# EAGLE design parallelNGtest (EAGLE 9.5.0)
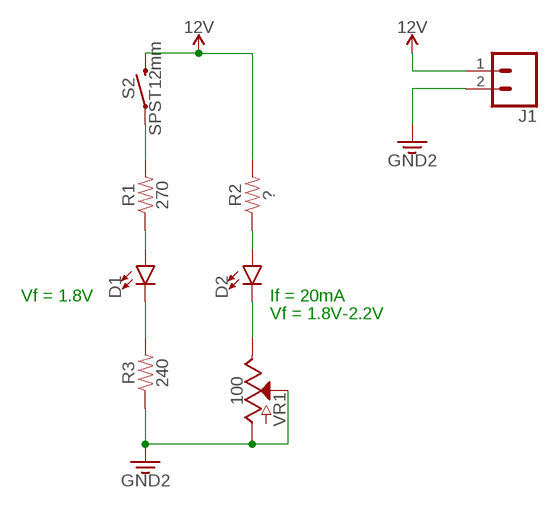
[diagram p0: schematic, sheet 1]

## Parts
D1  LED5MM  [LED_5MM]
D2  LED5MM  [LED_5MM]
J1  CONN_02PTH4  [1X02_XTRA_BIG]
R1  270  RESISTORAXIAL-0.3  [AXIAL-0.3]
R2  ?  RESISTORAXIAL-0.3  [AXIAL-0.3]
R3  240  RESISTORAXIAL-0.3  [AXIAL-0.3]
S2  SPST12mm  MOMENTARY-SWITCH-SPST-PTH-12MM  [TACTILE_SWITCH_PTH_12MM]
VR1  100  POTENTIOMETER-PTH-9MM-1/20W-20%  [POT-PTH-ALPS]

## Nets
3.3V: J1.2 R3.P$1 VR1.P$2(S) VR1.P$3(A) ; supply symbol labelled GND2
12V: J1.1 R2.P$2 S2.3
N$1: R1.P$2 S2.1
N$2: D1.A R1.P$1
N$3: D2.A R2.P$1
N$4: D1.K(C) R3.P$2
N$5: D2.K(C) VR1.P$1(E)

## Notes on the sheet
- Vf = 1.8V | If = 20mA
- Vf = 1.8V-2.2V

## Library data of the parts
D1 D2 = SparkFun-LED:LED: LED (Generic) Standard schematic elements and footprints for 5mm, 3mm, 1206, and 0603 sized LEDs. Generic LEDs with no color specified.
J1 = SparkFun-Connectors:CONN_02: Multi connection point. Often used as Generic Header-pin footprint for 0.1 inch spaced/style header connections On any of the 0.1 inch spaced packages, you can populate with these: Break Away Headers - Straight <https://www.sparkfun.com/products/116> (PRT-00116) Break Away Male Headers - Right Angle <https://www.sparkfun.com/products/553> (PRT-00553) Female Headers <https://www.sparkfun.com/products/115> (PRT-00115) Break Away Headers - Machine Pin <https://www.sparkfun.com/products/117> (PRT-00117) Break Away Female Headers - Swiss Machine Pin <https://www.sparkfun.com/products/743> (PRT-00743) For SCREWTERMINALS and SPRING TERMINALS visit here: Screw Terimnals on SparkFun.com <https://www.sparkfun.com/search/results?term=Screw+Terminals> (5mm/3.5mm/2.54mm spacing) This device is also useful as a general connection point to wire up your design to another part of your project. Our various solder wires solder well into these plated through hole pads. Hook-Up Wire - Assortment (Stranded, 22 AWG) <https://www.sparkfun.com/products/11375> (PRT-11375) Hook-Up Wire - Assortment (Solid Core, 22 AWG) <https://www.sparkfun.com/products/11367> (PRT-11367) View the entire wire category on our website here <https://www.sparkfun.com/categories/141> Special notes: Molex polarized connector foot print use with: PRT-08233 with associated crimp pins and housings. 2.54_SCREWTERM for use with PRT-10571. 3.5mm Screw Terminal footprints for PRT-08084 5mm Screw Terminal footprints for use with PRT-08432
R1-R3 = SparkFun-Resistors:RESISTOR: Generic Resistor Package
S2 = SparkFun-Switches:MOMENTARY-SWITCH-SPST: Momentary Switch (Pushbutton) - SPST Normally-open (NO) SPST momentary switches (buttons, pushbuttons). Variants PTH-12MM - 12mm square, through-hole Momentary Pushbutton Switch - 12mm Square <https://www.sparkfun.com/products/9190> (COM-09190) PTH-6.0MM, PTH-6.0MM-KIT - 6.0mm square, through-hole Mini Pushbutton Switch <https://www.sparkfun.com/products/97> (COM-00097) KIT package intended for soldering kit's - only one side of pads' copper is exposed. PTH-RIGHT-ANGLE-KIT - Right-angle, through-hole Right Angle Tactile Button <https://www.sparkfun.com/products/10791> - Used on SparkFun BigTime Watch Kit <https://www.sparkfun.com/products/11734> SMD-12MM - 12mm square, surface-mount Tactile Button - SMD (12mm) <https://www.sparkfun.com/products/12993> (COM-12993) Used on SparkFun PicoBoard <https://www.sparkfun.com/products/11888> SMD-4.5MM - 4.5mm Square Trackball Switch Used on SparkFun Blackberry Trackballer Breakout <https://www.sparkfun.com/products/13169> SMD-4.6MMX2.8MM - 4.60mm x 2.80mm, surface mount Used on SparkFun SAMD21 Mini Breakout <https://www.sparkfun.com/products/13664> SMD-5.2MM, SMD-5.2-REDUNDANT - 5.2mm square, surface-mount Mini Pushbutton Switch - SMD <https://www.sparkfun.com/products/8720> (COM-08720) Used on Arduino Pro Mini <https://www.sparkfun.com/products/11114> REDUNDANT package connects both switch circuits together SMD-6.0X3.5MM - 6.0 x 3.5mm, surface mount Momentary Reset Switch SMD <https://www.sparkfun.com/products/8229> (COM-08229) SMD-6.2MM-TALL - 6.2mm square, surface mount Tactile Button - SMD (6mm) <https://www.sparkfun.com/products/12992> Used on SparkFun Digital Sandbox <https://www.sparkfun.com/products/12651> SMD-RIGHT-ANGLE - Right-angle, surface mount Used on SparkFun Block for Intel® Edison - Arduino <https://www.sparkfun.com/products/13036>; PROD_ID: SWCH-09185; SF_SKU: COM-09190
VR1 = SparkFun-Resistors:POTENTIOMETER: Potentiometer (Pot) Three-terminal potentiometers, with an adjustable wiper and two adjustable resistors. A pot can be used to create a configurable voltage divider, or as a variable resistor. Variants ALPS_POT and ALPS_POT_KIT - PTH, breadboard compatible, 9mm square pots Rotary Potentiometer - Linear (10k ohm) <https://www.sparkfun.com/products/9288> (COM-09288) The KIT variant exposes copper on only one side of the PTH pad, so the part can only be assembled on one side of the PCB. Useful for beginner soldering kits.; PROD_ID: RES-09177; SF_SKU: COM-09288; VALUE: 10k

## Board
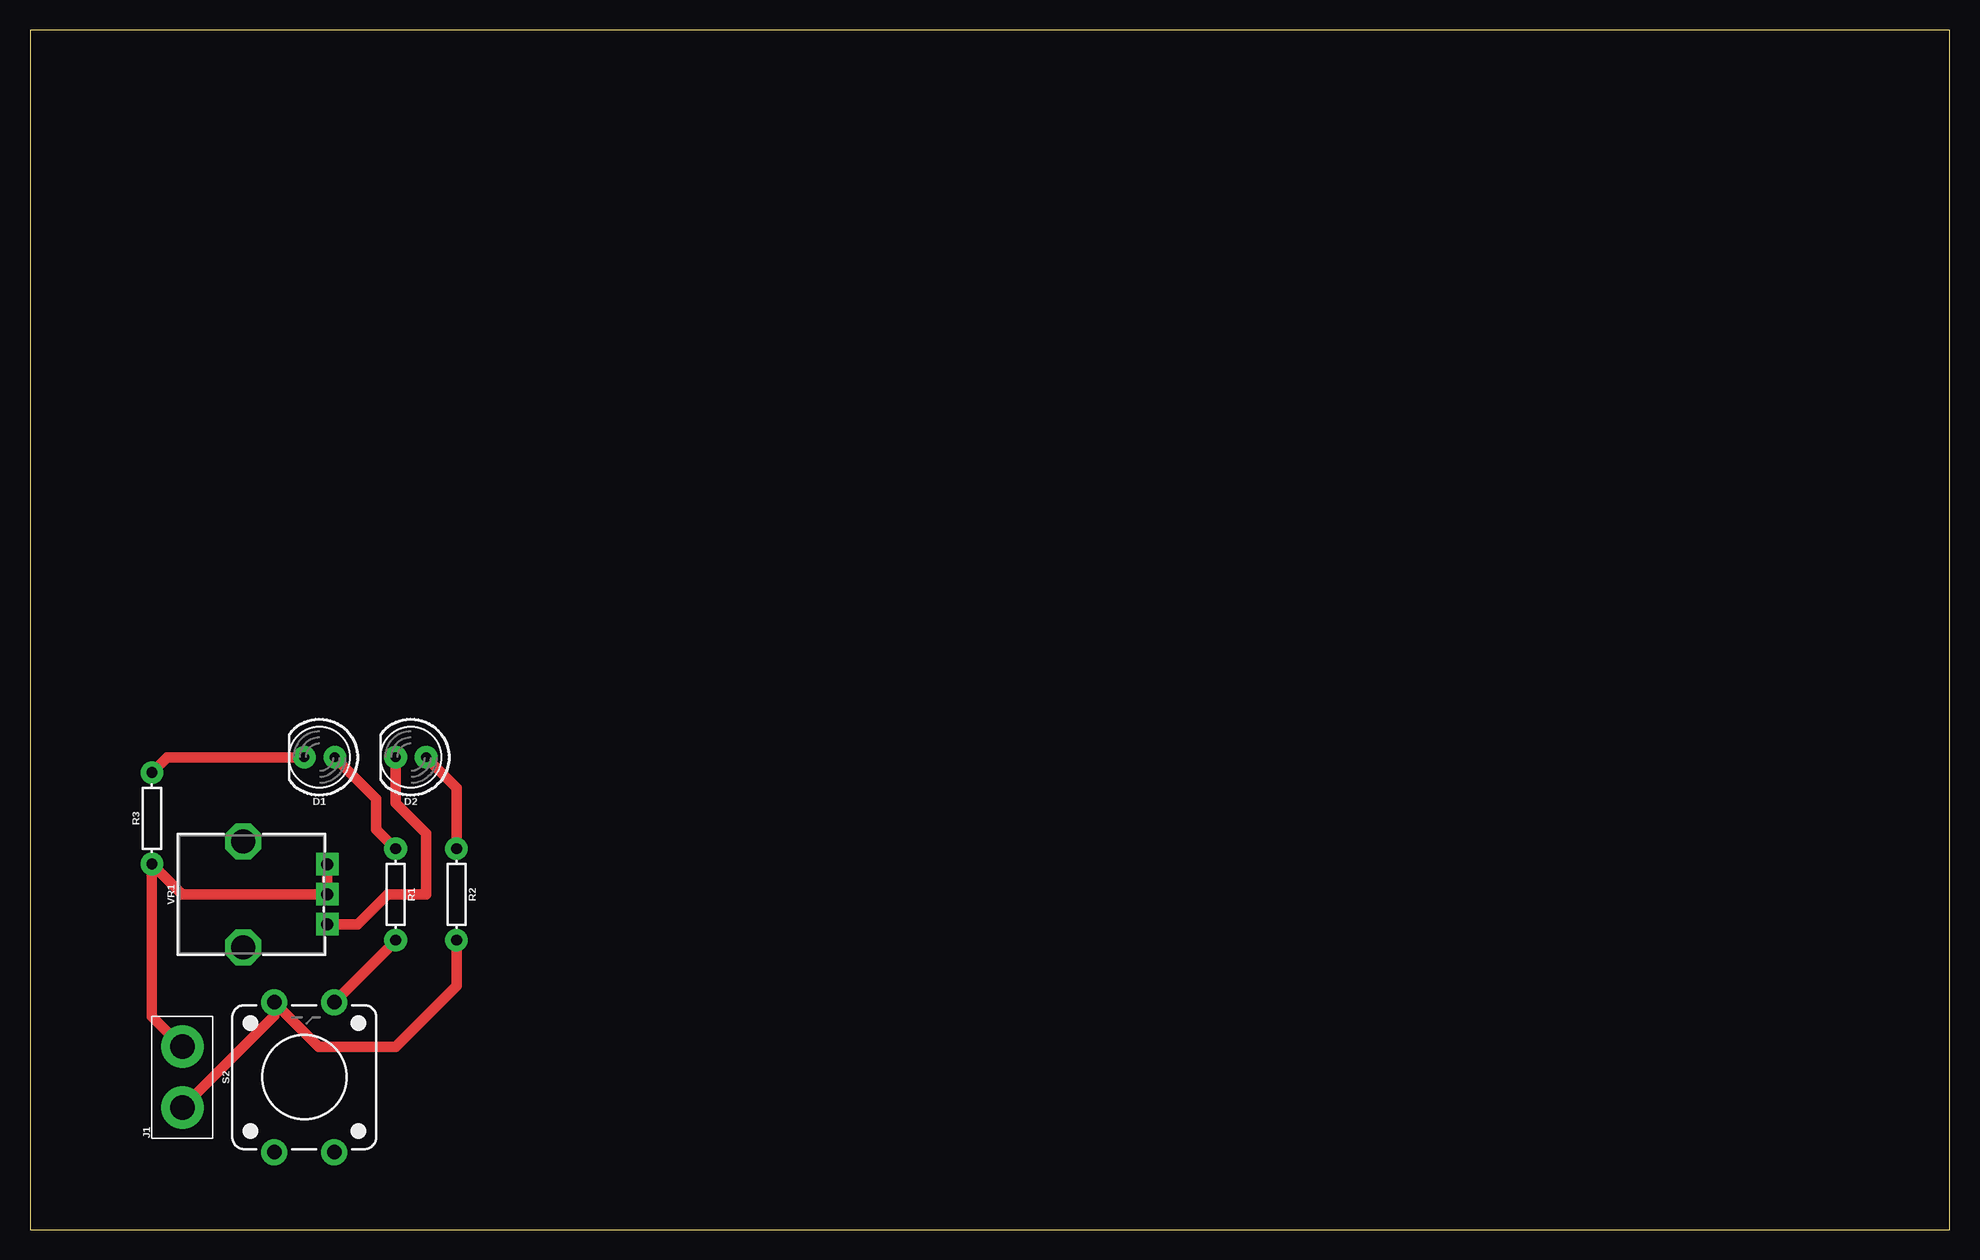
[diagram p1: board, top side]
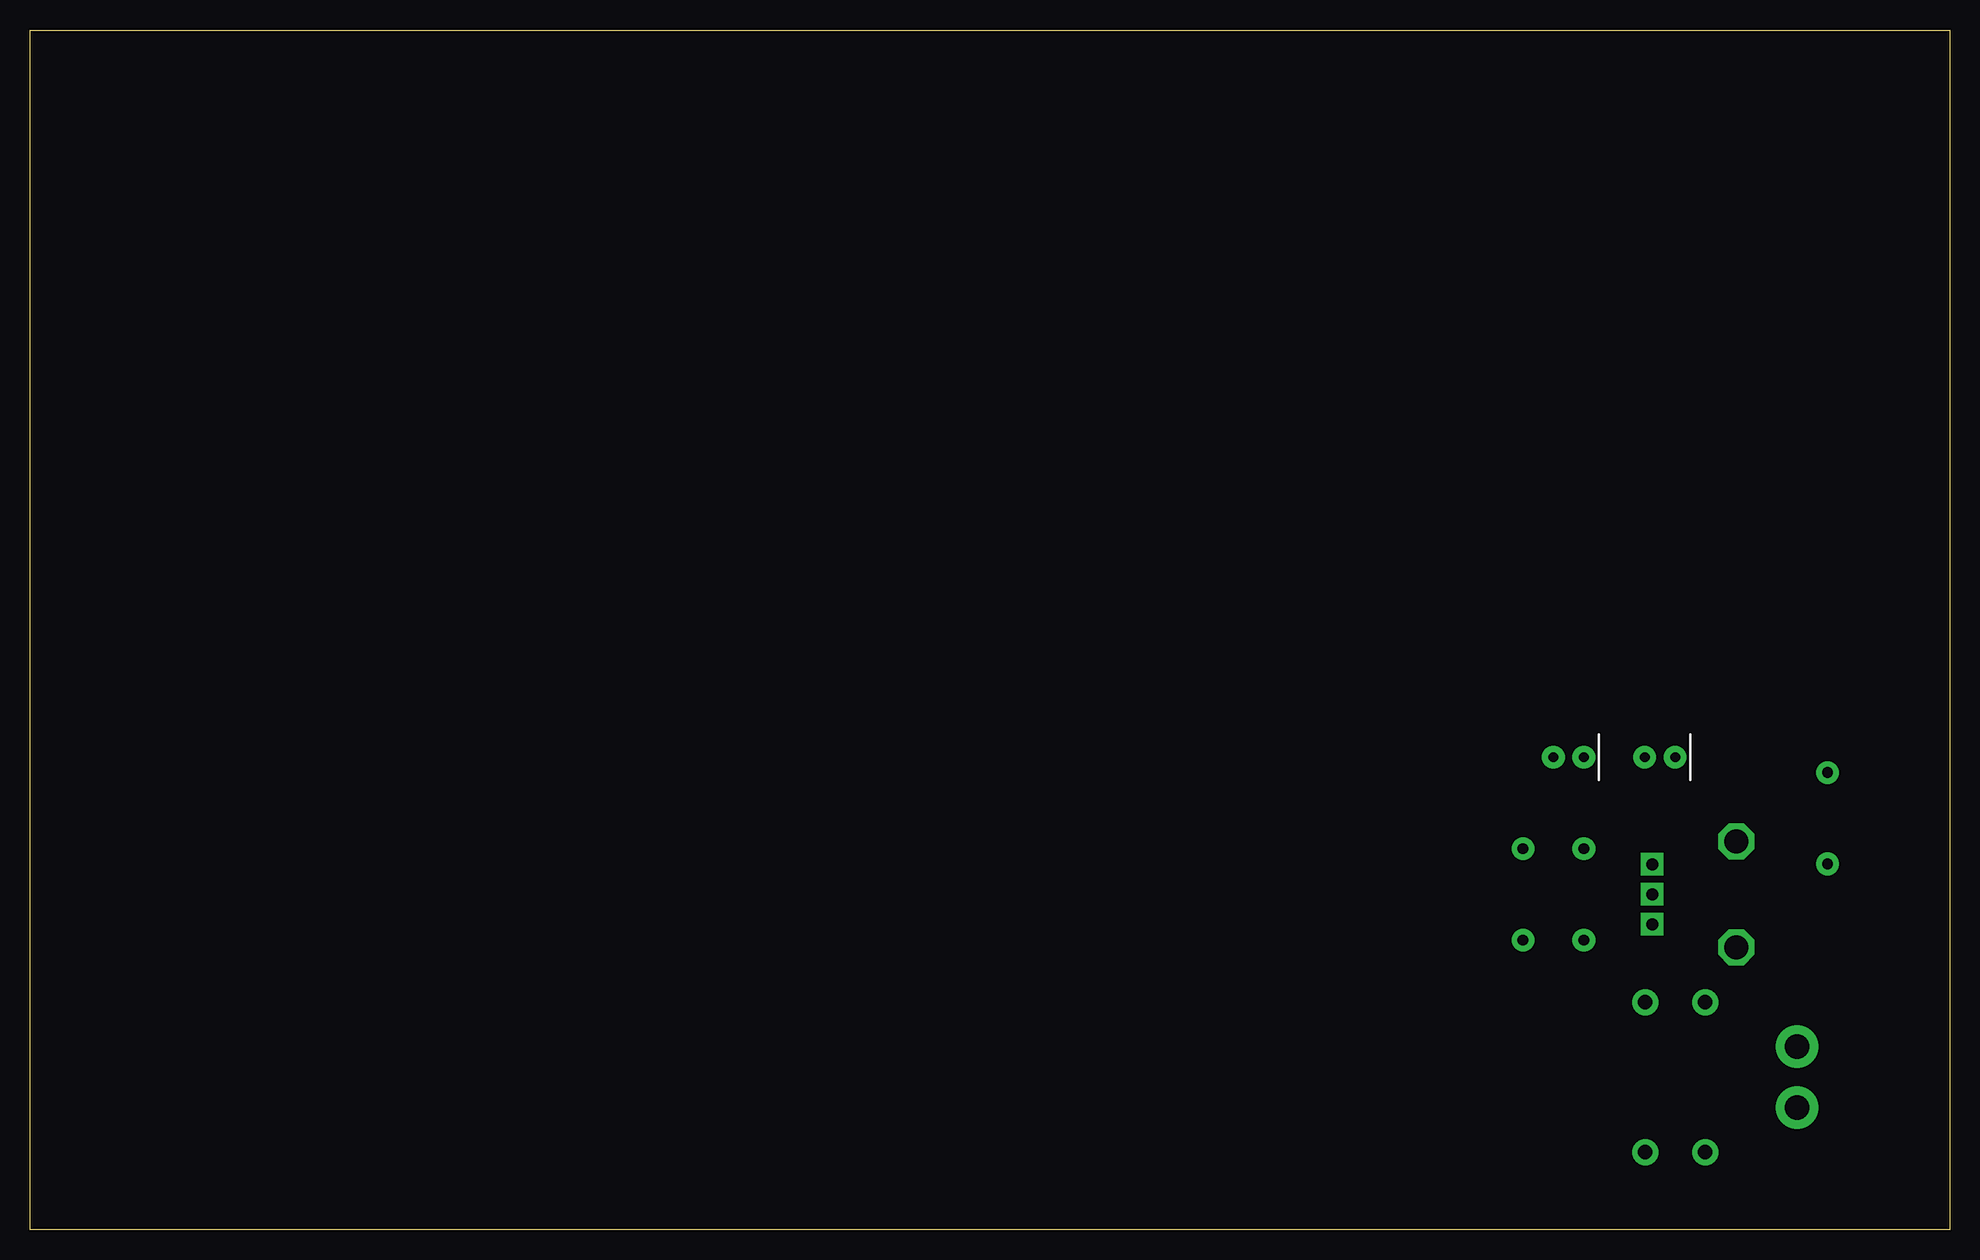
[diagram p2: board, bottom side, seen from below]

Size 160 x 100 mm. Coordinates in mm from the lower left corner, seen from the top.
Outline: 0,0 160,0 160,100 0,100 0,0
Copper layers (1*16): Top 0.035mm / dielectric 1.5mm / Bottom 0.035mm
Design rules "default *": minimum track width 35mil, minimum drill 0.35mm, track to track 6mil, track to pad 6mil, pad to pad 6mil, via to via 6mil, smd to smd 6mil, copper to edge 20mil, drill to drill 6mil, minimum pad ring 10mil, minimum via ring 8mil, stop-mask expansion 4mil, vias tented up to drill 0mil, thermal gap 10mil

### Footprints (pad centres in the part's own frame; a part is rotated, then mirrored left to right if it is on the bottom)
LED_5MM = drill 0.813 pad 1.88: A -1.27,0; K 1.27,0
1X02_XTRA_BIG = drill 2.057 pad 3.556: 1 -2.54,0; 2 2.54,0
AXIAL-0.3 = drill 0.9 pad 1.88: P$1 -3.81,0; P$2 3.81,0
TACTILE_SWITCH_PTH_12MM = drill 1.2 pad 2.159: 1 6.25,-2.5; 2 -6.25,-2.5; 3 6.25,2.5; 4 -6.25,2.5
POT-PTH-ALPS = drill 1 pad 1.88 square: P$1 7,-2.5; P$2 7,0; P$3 7,2.5 | drill 2 octagon: P$4 0,-4.4; P$5 0,4.4

### Placement (x,y rotation side)
D1  24.13,39.37 180 top
D2  31.75,39.37 180 top
J1  12.7,12.7 90 top
R1  30.48,27.94 270 top
R2  35.56,27.94 270 top
R3  10.16,34.29 90 top
S2  22.86,12.7 90 top
VR1  17.78,27.94 0 top

### Tracks (layer width: path | path; a pad name or v marks a point on that pad's centre or on a via)
3.3V
  Top 0.889: J1.2 10.16,17.78 R3.P$1 12.7,27.94 VR1.P$2 VR1.P$3
12V
  Top 0.889: J1.1 20.36,17.82 S2.3 24.07,15.24 30.48,15.24 35.56,20.32 R2.P$2
N$1
  Top 0.889: S2.1 30.48,24.07 R1.P$2
N$2
  Top 0.889: R1.P$1 28.86,33.37 28.86,35.91 D1.A
N$3
  Top 0.889: D2.A 35.56,36.83 R2.P$1
N$4
  Top 0.889: R3.P$2 11.43,39.37 D1.K
N$5
  Top 0.889: D2.K 30.48,35.56 33.02,33.02 33.02,27.94 29.82,27.94 27.32,25.44 VR1.P$1